# Altium schematic sheet 34_14.SchDoc
size B
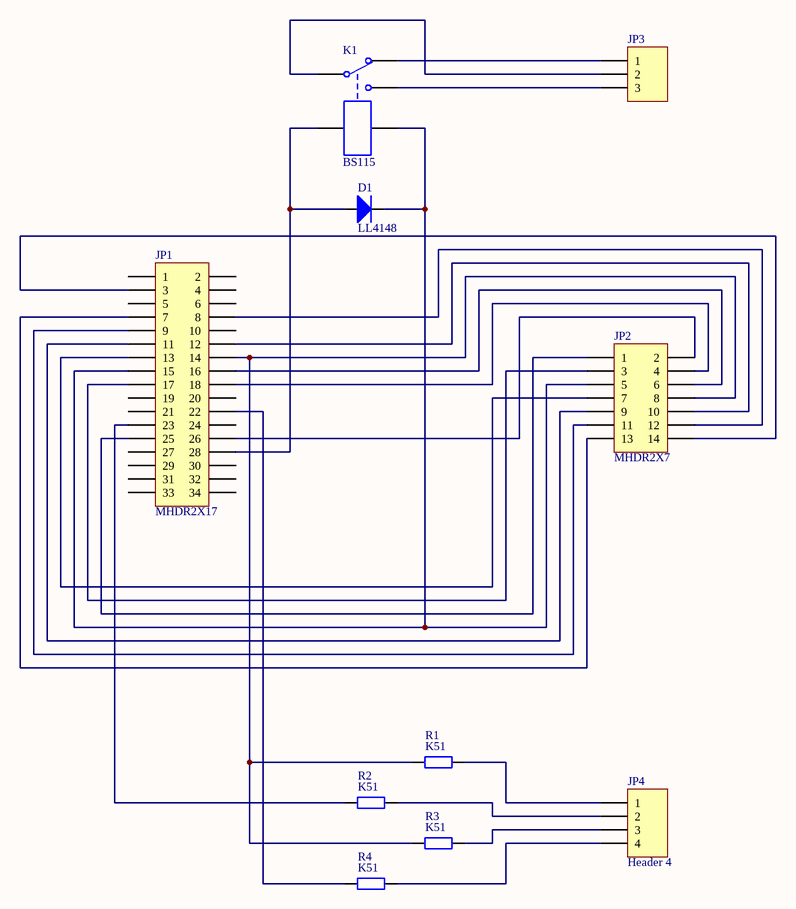
[diagram p0: 34_14.SchDoc]

## Parts
D1  LL4148  [_1206d]
JP1  MHDR2X17  [HDR2X17]
JP2  MHDR2X7  [HDR2X7]
JP3  Header 3  [2EDG-5.08-3P]  (value not drawn)
JP4  Header 4  [2EDG-5.08-4P - duplicate]
K1  BS115  [bs115]
R1  K51  [_1206]
R2  K51  [_1206]
R3  K51  [_1206]
R4  K51  [_1206]

## Nets
NetD1_1: D1.1(A) JP1.28 K1.4
NetD1_2: D1.2(K) JP1.15 JP2.5 K1.5
NetJP1_3: JP1.3 JP2.14
NetJP1_7: JP1.7 JP2.13
NetJP1_8: JP1.8 JP2.12
NetJP1_9: JP1.9 JP2.11
NetJP1_11: JP1.11 JP2.9
NetJP1_12: JP1.12 JP2.10
NetJP1_13: JP1.13 JP2.7
NetJP1_14: JP1.14 JP2.8 R1.1 R3.1
NetJP1_16: JP1.16 JP2.6
NetJP1_17: JP1.17 JP2.3
NetJP1_18: JP1.18 JP2.4
NetJP1_22: JP1.22 R4.1
NetJP1_23: JP1.23 R2.1
NetJP1_25: JP1.25 JP2.1
NetJP1_26: JP1.26 JP2.2
NetJP3_1: JP3.1 K1.2
NetJP3_2: JP3.2 K1.1
NetJP3_3: JP3.3 K1.3
NetJP4_1: JP4.1 R1.2
NetJP4_2: JP4.2 R2.2
NetJP4_3: JP4.3 R3.2
NetJP4_4: JP4.4 R4.2

Not connected (* = marked no-connect by the designer): JP1 1 2 4 5 6 10 19 20 21 24 27 29 30 31 32 33 34

## Library data of the parts
D1 = Diode: Manufacturer: Generic Components; Class I: Discrete; Class II: Diode - Switching; Published: 8-Jun-2000; Revision: July-2002: Re-released for DXP Platform.; Publisher: Altium Limited; Value: LL4148
JP1 = MHDR2X17: Header, 17-Pin, Dual row; Manufacturer: Generic Components; Class I: Connector; Revision: July-2002: Re-released for DXP Platform.; Publisher: Altium Limited
JP2 = MHDR2X7: Header, 7-Pin, Dual row; Manufacturer: Generic Components; Class I: Connector; Revision: July-2002: Re-released for DXP Platform.; Publisher: Altium Limited
JP3 = Header 3: Header, 3-Pin; Manufacturer: Generic Components; Class I: Connector; Revision: July-2002: Re-released for DXP Platform.; Publisher: Altium Limited
JP4 = Header 4: Header, 4-Pin; Manufacturer: Generic Components; Class I: Connector; Revision: July-2002: Re-released for DXP Platform.; Publisher: Altium Limited
K1 = BS115: Single-Pole Dual-Throw Relay; Manufacturer: Generic Components; Class I: Electro-mechanical; Published: 24-Mar-1999; Revision: July-2002: Re-released for DXP Platform.; Publisher: Altium Limited; Class II: Relay
R1-R4 = Res2: Resistor; Manufacturer: Generic Components; Class I: Passive; Value: 1K; Published: 8-Jun-2000; Revision: July-2002: Re-released for DXP Platform.; Publisher: Altium Limited; Class II: Resistor